# Altium schematic sheet IR_GATE_DRIVER_1.SchDoc: IR_GATE_DRIVER_1
size 420 x 297 mm; Engineer: ALPER KORKMAZ; SheetNumber: 5; SheetTotal: 8; SHEET: 5
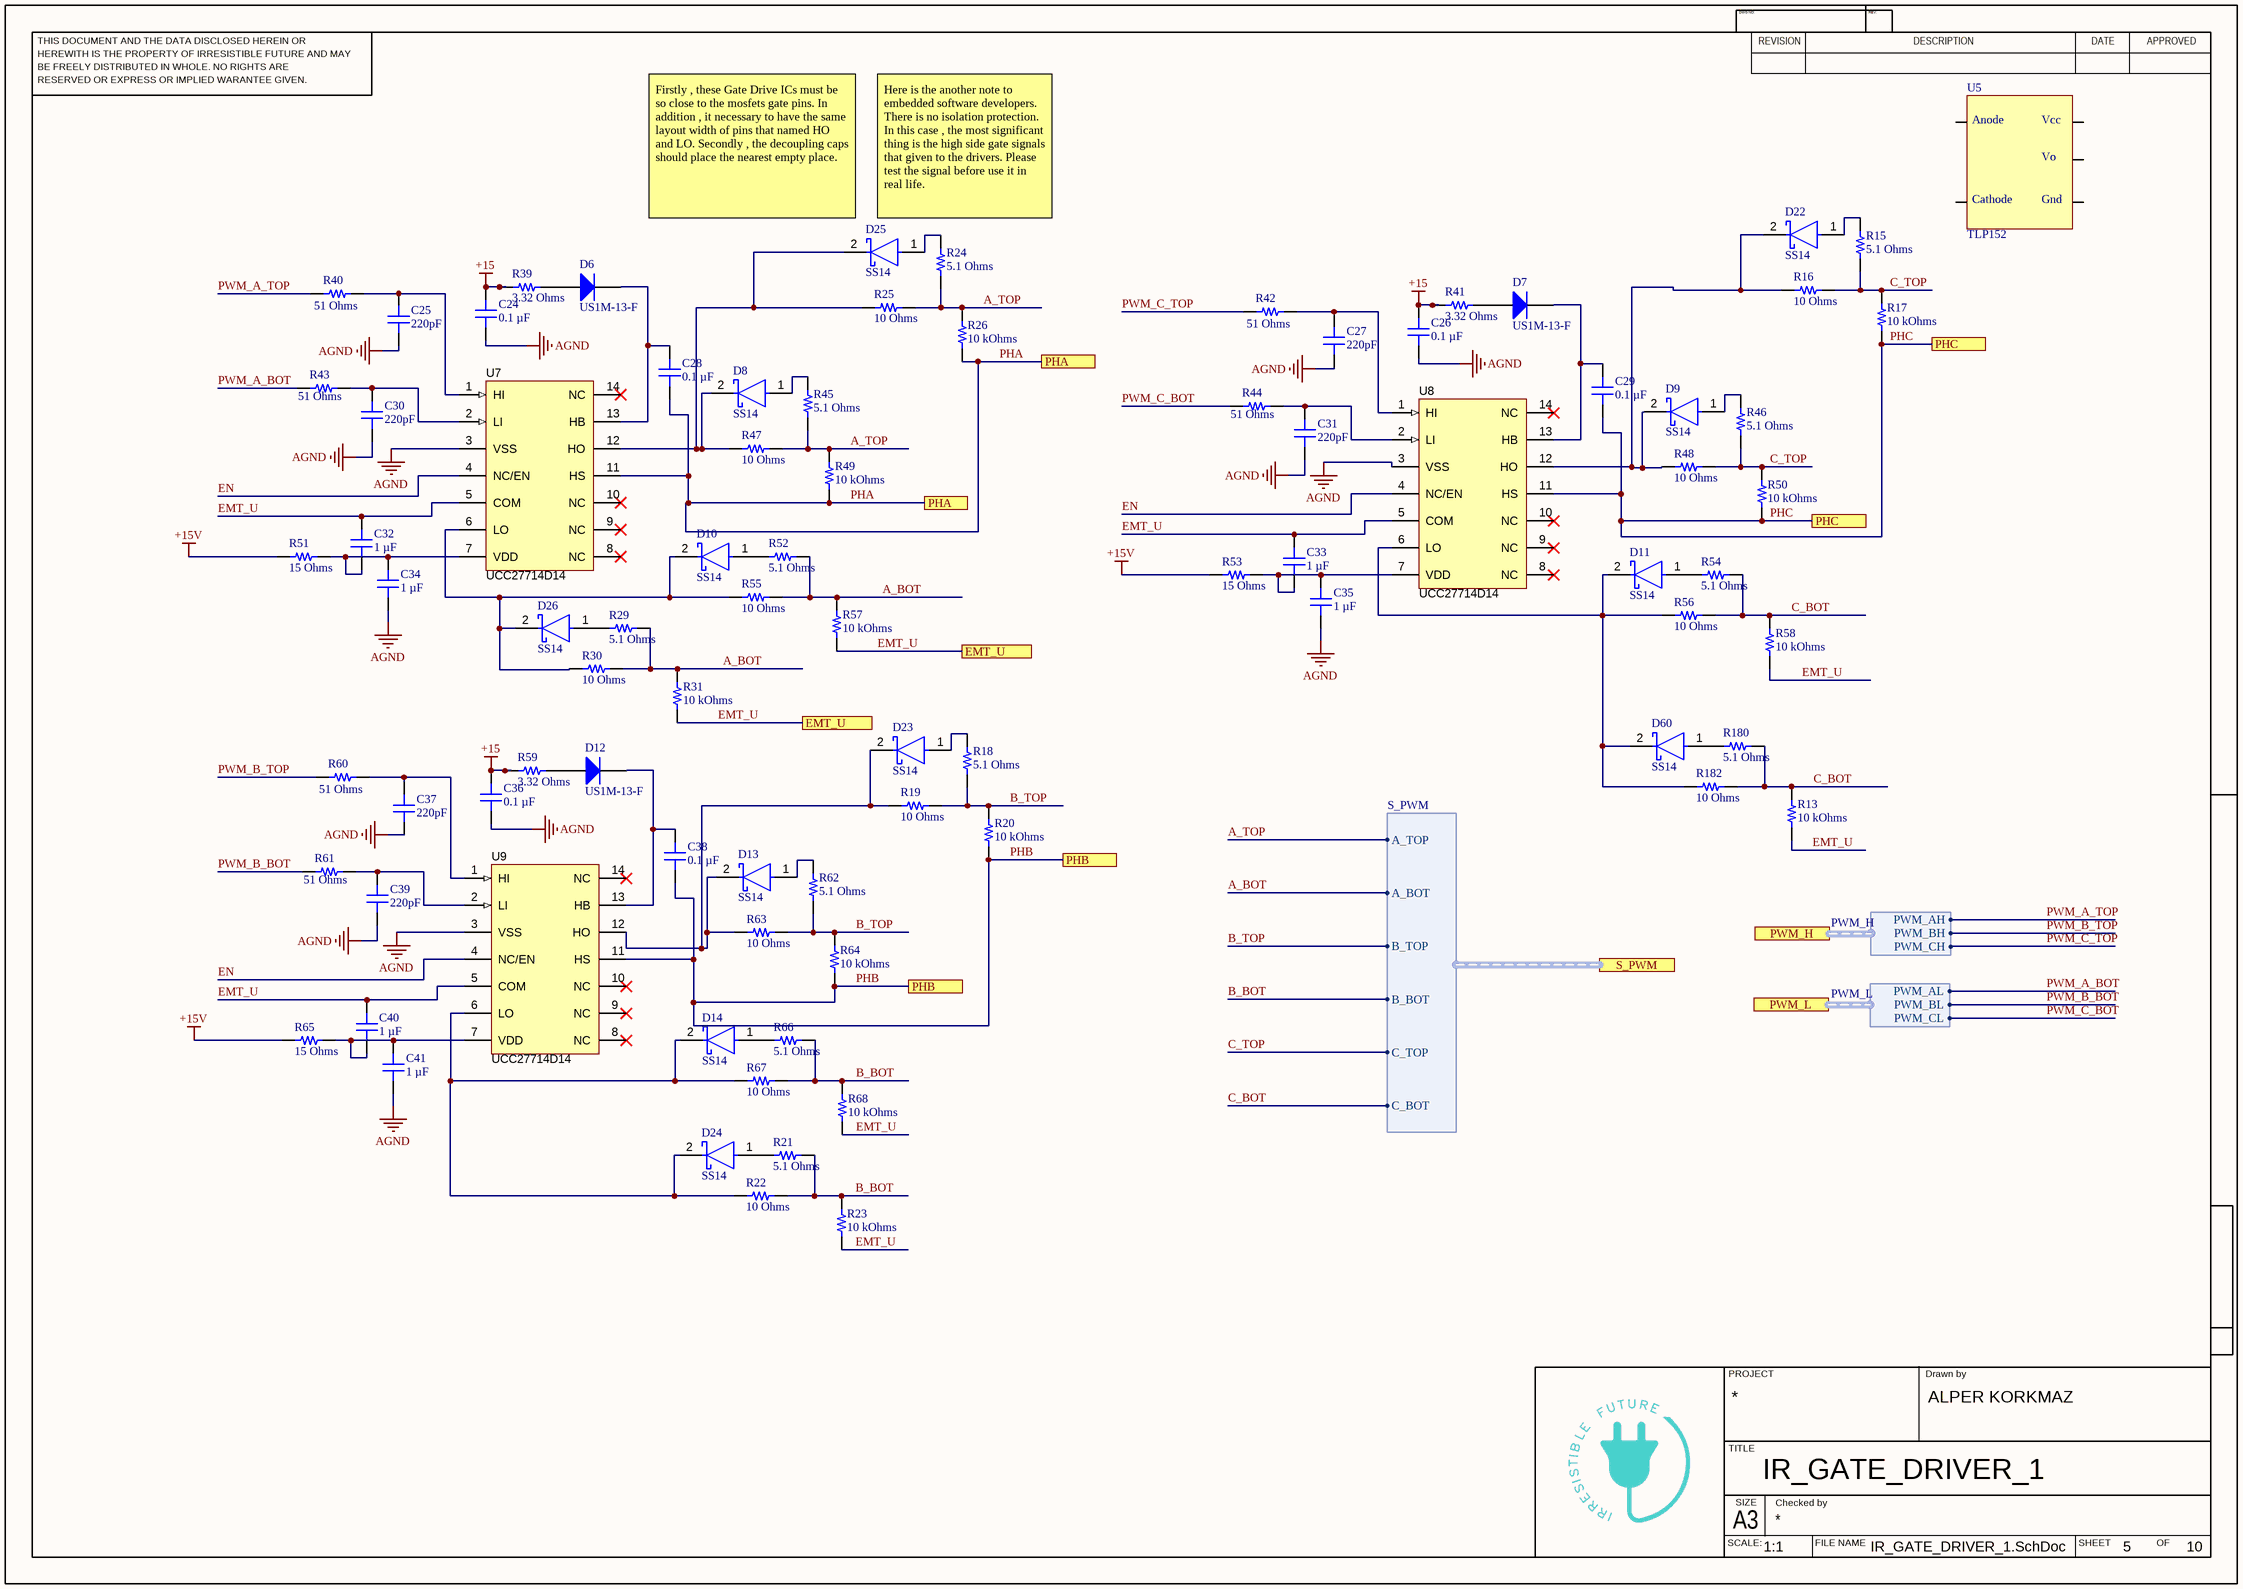
[diagram p0: IR_GATE_DRIVER_1.SchDoc]

## Parts
C24  0.1 µF  [CAP 0603_1608]
C25  220pF  [CAP 0603_1608]
C26  0.1 µF  [CAP 0603_1608]
C27  220pF  [CAP 0603_1608]
C28  0.1 µF  [CAP 0603_1608]
C29  0.1 µF  [CAP 0603_1608]
C30  220pF  [CAP 0603_1608]
C31  220pF  [CAP 0603_1608]
C32  1 µF  [CAP 0603_1608]
C33  1 µF  [CAP 0603_1608]
C34  1 µF  [CAP 0603_1608]
C35  1 µF  [CAP 0603_1608]
C36  0.1 µF  [CAP 0603_1608]
C37  220pF  [CAP 0603_1608]
C38  0.1 µF  [CAP 0603_1608]
C39  220pF  [CAP 0603_1608]
C40  1 µF  [CAP 0603_1608]
C41  1 µF  [CAP 0603_1608]
D6  US1M-13-F  [DIOD-SMA-2_A_V]
D7  US1M-13-F  [DIOD-SMA-2_A_V]
D8  SS14  [FP-403AE-MFG]
D9  SS14  [FP-403AE-MFG]
D10  SS14  [FP-403AE-MFG]
D11  SS14  [FP-403AE-MFG]
D12  US1M-13-F  [DIOD-SMA-2_A_V]
D13  SS14  [FP-403AE-MFG]
D14  SS14  [FP-403AE-MFG]
D22  SS14  [FP-403AE-MFG]
D23  SS14  [FP-403AE-MFG]
D24  SS14  [FP-403AE-MFG]
D25  SS14  [FP-403AE-MFG]
D26  SS14  [FP-403AE-MFG]
D60  SS14  [FP-403AE-MFG]
R13  10 kOhms  [RES 0603_1608]
R15  5.1 Ohms  [RES 0603_1608]
R16  10 Ohms  [RES 0603_1608]
R17  10 kOhms  [RES 0603_1608]
R18  5.1 Ohms  [RES 0603_1608]
R19  10 Ohms  [RES 0603_1608]
R20  10 kOhms  [RES 0603_1608]
R21  5.1 Ohms  [RES 0603_1608]
R22  10 Ohms  [RES 0603_1608]
R23  10 kOhms  [RES 0603_1608]
R24  5.1 Ohms  [RES 0603_1608]
R25  10 Ohms  [RES 0603_1608]
R26  10 kOhms  [RES 0603_1608]
R29  5.1 Ohms  [RES 0603_1608]
R30  10 Ohms  [RES 0603_1608]
R31  10 kOhms  [RES 0603_1608]
R39  3.32 Ohms  [RES 0603_1608]
R40  51 Ohms  [RES 0603_1608]
R41  3.32 Ohms  [RES 0603_1608]
R42  51 Ohms  [RES 0603_1608]
R43  51 Ohms  [RES 0603_1608]
R44  51 Ohms  [RES 0603_1608]
R45  5.1 Ohms  [RES 0603_1608]
R46  5.1 Ohms  [RES 0603_1608]
R47  10 Ohms  [RES 0603_1608]
R48  10 Ohms  [RES 0603_1608]
R49  10 kOhms  [RES 0603_1608]
R50  10 kOhms  [RES 0603_1608]
R51  15 Ohms  [RES 0603_1608]
R52  5.1 Ohms  [RES 0603_1608]
R53  15 Ohms  [RES 0603_1608]
R54  5.1 Ohms  [RES 0603_1608]
R55  10 Ohms  [RES 0603_1608]
R56  10 Ohms  [RES 0603_1608]
R57  10 kOhms  [RES 0603_1608]
R58  10 kOhms  [RES 0603_1608]
R59  3.32 Ohms  [RES 0603_1608]
R60  51 Ohms  [RES 0603_1608]
R61  51 Ohms  [RES 0603_1608]
R62  5.1 Ohms  [RES 0603_1608]
R63  10 Ohms  [RES 0603_1608]
R64  10 kOhms  [RES 0603_1608]
R65  15 Ohms  [RES 0603_1608]
R66  5.1 Ohms  [RES 0603_1608]
R67  10 Ohms  [RES 0603_1608]
R68  10 kOhms  [RES 0603_1608]
R180  5.1 Ohms  [RES 0603_1608]
R182  10 Ohms  [RES 0603_1608]
U5  TLP152  [TLP152]
U7  UCC27714D14  [D0014A_N]
U8  UCC27714D14  [D0014A_N]
U9  UCC27714D14  [D0014A_N]

## Ports
EMT_U (see 1[3A], 4[3D]), PHA (see 1[3A], 4[2B]), PHB (see 1[3A], 4[2C]), PHC (see 1[3A], 4[4B]), PWM_H (harness PWM_H, see 1[2A], 3[2B]), PWM_L (harness PWM_L, see 1[2A], 3[2B]), S_PWM (harness S_PWM, see 1[3A], 4[6C])

## Harnesses
S_PWM: A_TOP, A_BOT, B_TOP, B_BOT, C_TOP, C_BOT
PWM_H: PWM_CH, PWM_BH, PWM_AH
PWM_L: PWM_CL, PWM_BL, PWM_AL

## Nets
+15: C24.2 C26.2 C36.2 R39.1 R41.1 R59.1
+15V: R51.1 R53.1 R65.1
AGND: C24.1 C25.1 C26.1 C27.1 C30.1 C31.1 C34.1 C35.1 C36.1 C37.1 C39.1 C41.1 U7.3(VSS) U8.3(VSS) U9.3(VSS)
A_BOT: R29.2 R30.2 R31.2 R52.2 R55.2 R57.2 ; port S_PWM.A_BOT
A_TOP: R24.2 R25.2 R26.2 R45.2 R47.2 R49.2 ; port S_PWM.A_TOP
B_BOT: R21.2 R22.2 R23.2 R66.2 R67.2 R68.2 ; port S_PWM.B_BOT
B_TOP: R18.2 R19.2 R20.2 R62.2 R63.2 R64.2 ; port S_PWM.B_TOP
C_BOT: R13.2 R54.2 R56.2 R58.2 R180.2 R182.2 ; port S_PWM.C_BOT
C_TOP: R15.2 R16.2 R17.2 R46.2 R48.2 R50.2 ; port S_PWM.C_TOP
EMT_U: C32.2 C33.2 C40.2 R13.1 R23.1 R31.1 R57.1 R58.1 R68.1 U7.5(COM) U8.5(COM) U9.5(COM) ; port EMT_U
EN: U7.4(NC/EN) U8.4(NC/EN) U9.4(NC/EN)
PHA: C28.1 R26.1 R49.1 U7.11(HS) ; port PHA
PHB: C38.1 R20.1 R64.1 U9.11(HS) ; port PHB
PHC: C29.1 R17.1 R50.1 U8.11(HS) ; port PHC
PWM_A_BOT: R43.1 ; port PWM_L.PWM_AL
PWM_A_TOP: R40.1 ; port PWM_H.PWM_AH
PWM_B_BOT: R61.1 ; port PWM_L.PWM_BL
PWM_B_TOP: R60.1 ; port PWM_H.PWM_BH
PWM_C_BOT: R44.1 ; port PWM_L.PWM_CL
PWM_C_TOP: R42.1 ; port PWM_H.PWM_CH
NetC25_2: C25.2 R40.2 U7.1(HI)
NetC27_2: C27.2 R42.2 U8.1(HI)
NetC28_2: C28.2 D6.2(K) U7.13(HB)
NetC29_2: C29.2 D7.2(K) U8.13(HB)
NetC30_2: C30.2 R43.2 U7.2(LI)
NetC31_2: C31.2 R44.2 U8.2(LI)
NetC32_1: C32.1 C34.2 R51.2 U7.7(VDD)
NetC33_1: C33.1 C35.2 R53.2 U8.7(VDD)
NetC37_2: C37.2 R60.2 U9.1(HI)
NetC38_2: C38.2 D12.2(K) U9.13(HB)
NetC39_2: C39.2 R61.2 U9.2(LI)
NetC40_1: C40.1 C41.2 R65.2 U9.7(VDD)
NetD6_1: D6.1(A) R39.2
NetD7_1: D7.1(A) R41.2
NetD8_1: D8.1(A) R45.1
NetD8_2: D8.2(C) D25.2(C) R25.1 R47.1 U7.12(HO)
NetD9_1: D9.1(A) R46.1
NetD9_2: D9.2(C) D22.2(C) R16.1 R48.1 U8.12(HO)
NetD10_1: D10.1(A) R52.1
NetD10_2: D10.2(C) D26.2(C) R30.1 R55.1 U7.6(LO)
NetD11_1: D11.1(A) R54.1
NetD11_2: D11.2(C) D60.2(C) R56.1 R182.1 U8.6(LO)
NetD12_1: D12.1(A) R59.2
NetD13_1: D13.1(A) R62.1
NetD13_2: D13.2(C) D23.2(C) R19.1 R63.1 U9.12(HO)
NetD14_1: D14.1(A) R66.1
NetD14_2: D14.2(C) D24.2(C) R22.1 R67.1 U9.6(LO)
NetD22_1: D22.1(A) R15.1
NetD23_1: D23.1(A) R18.1
NetD24_1: D24.1(A) R21.1
NetD25_1: D25.1(A) R24.1
NetD26_1: D26.1(A) R29.1
NetD60_1: D60.1(A) R180.1

Not connected (* = marked no-connect by the designer): U5 1 2 3 4 5; U7 8(NC)* 9(NC)* 10(NC)* 14(NC)*; U8 8(NC)* 9(NC)* 10(NC)* 14(NC)*; U9 8(NC)* 9(NC)* 10(NC)* 14(NC)*

## Notes on the sheet
- (near D25) Firstly , these Gate Drive ICs must be so close to the mosfets gate pins. In addition , it necessary to have the same layout width of pins that named HO and LO. Secondly , the decoupling caps should place the nearest empty place.
- Here is the another note to embedded software developers. There is no isolation protection. In this case , the most significant thing is the high side gate signals that given to the drivers. Please test the signal before use it in real life.
- THIS DOCUMENT AND THE DATA DISCLOSED HEREIN OR
- HEREWITH IS THE PROPERTY OF IRRESISTIBLE FUTURE AND MAY
- DWG NO:
- REVISION
- REV:
- DESCRIPTION
- DATE
- APPROVED
- BE FREELY DISTRIBUTED IN WHOLE. NO RIGHTS ARE
- RESERVED OR EXPRESS OR IMPLIED WARANTEE GIVEN.
- PROJECT
- Drawn by
- TITLE
- SCALE:
- A3
- SIZE
- Checked by
- FILE NAME
- SHEET
- OF
- 1:1
- 10
- (in symbol TLP152(TPL,E) Anode; Vcc; Vo; Cathode; Gnd

## Library data of the parts
C24 C26 C28 C29 C36 C38 = C0603C104K5RAC7411: CAP CER 0.1UF 50V X7R 0603; manufacturer: KEMET; Tolerance: ±10%; Part Number: C0603C104K5RAC7411; Value: 0.1 µF; Applications: Bypass, Decoupling; Capacitance: 0.1 µF; componentlink1description: Datasheet; componentlink1url: https://api.kemet.com/component-edge/download/datasheet/C0603C104K5RAC7411.pdf; componentlink2description: DigiKey Link; componentlink2url: https://www.digikey.com/en/products/detail/kemet/C0603C104K5RAC7411/3317013; Device Package: 0603 (1608 Metric); lastupdated: 11.07.2022 14:43:54; Lifecycle Status: Active; Minimum Order: 15000; Mounting Type: Surface Mount, MLCC; Operating Temperature: -55°C ~ 125°C; Package / Case: 0603 (1608 Metric); packaging: TapeAndReel; partid: 2233; Part Status: Active; price: 0.01; series: SMD Comm X7R; Size / Dimension: 0.063" L x 0.031" W (1.60mm x 0.80mm); Supplier 1: DigiKey; Supplier Part Number 1: 399-7374-2-ND; Temperature Coefficient: X7R; Thickness (Max): 0.035" (0.90mm); Voltage - Rated: 50V
C25 C27 C30 C31 C37 C39 = 06031C221KAT2A: CAP CER 220PF 100V X7R 0603; manufacturer: AVX Corporation; Tolerance: ±10%; Part Number: 06031C221KAT2A; Value: 220pF; Applications: General Purpose; Capacitance: 220pF; componentlink1description: Datasheet; componentlink1url: http://datasheets.avx.com/X7RDielectric.pdf; componentlink2description: DigiKey Link; componentlink2url: http://digikey.com/product-detail/en/avx-corporation/06031C221KAT2A/478-1195-1-ND/564227; Device Package: 0603 (1608 Metric); lastupdated: 2.09.2020 01:03:35; Lifecycle Status: Active; Minimum Order: 1; Mounting Type: Surface Mount, MLCC; Operating Temperature: -55°C ~ 125°C; Package / Case: 0603 (1608 Metric); packaging: TapeAndReel; partid: 2841; Part Status: Active; price: 0.02; series: -; Size / Dimension: 0.063" L x 0.032" W (1.60mm x 0.81mm); Supplier 1: DigiKey; Supplier Part Number 1: 478-1195-1-ND; Temperature Coefficient: X7R; Thickness (Max): 0.035" (0.90mm); Voltage - Rated: 100V
C32-C35 C40 C41 = C0603C105K4RACAUTO: CAP CER 1UF 16V X7R 0603; manufacturer: KEMET; Tolerance: ±10%; Part Number: C0603C105K4RACAUTO; Value: 1 µF; Applications: Automotive, Bypass, Decoupling; Capacitance: 1 µF; componentlink1description: Datasheet; componentlink1url: https://api.kemet.com/component-edge/download/datasheet/C0603C105K4RACAUTO.pdf; componentlink2description: DigiKey Link; componentlink2url: https://www.digikey.com/en/products/detail/kemet/C0603C105K4RACAUTO/8635831; Device Package: 0603 (1608 Metric); lastupdated: 11.07.2022 14:43:54; Lifecycle Status: Active; Minimum Order: 1; Mounting Type: Surface Mount, MLCC; Operating Temperature: -55°C ~ 125°C; Package / Case: 0603 (1608 Metric); packaging: TapeAndReel; partid: 2179; Part Status: Active; price: 0.01; Ratings: AEC-Q200; series: SMD Auto X7R; Size / Dimension: 0.063" L x 0.031" W (1.60mm x 0.80mm); Supplier 1: DigiKey; Supplier Part Number 1: 399-17704-1-ND; Temperature Coefficient: X7R; Thickness (Max): 0.037" (0.95mm); Voltage - Rated: 16V
D6 D7 D12 = CMP-2000-07364-1: Ultra-Fast Rectifier, 1 A, 1.7 V, -65 to 150 degC, 2-Pin SMA, RoHS, Tape and Reel; Manufacturer: Diodes Inc; Forward Voltage: 1.7V; Reverse Recovery Time-Max: 75ns; Average Rectified Current-Max: 1A; Reverse Current-Max: 5µA; Reverse Voltage-Max [Vrrm]: 1000V; Package Description: 2-Pin Surface Mount Device, Body 4.3 x 2.605 mm; Datasheet URL: http://www.diodes.com/_files/datasheets/ds16008.pdf; Datasheet Version: Rev. 11-2, 12/2014; Package Reference: SMA-2; Mounting Technology: SurfaceMount; Manufacturer URL: http://www.diodes.com/
D8-D11 D13 D14 D22-D26 D60 = CMP-2000-04943-2: DIODE SCHOTTKY 40V 1A SMA; Manufacturer: ON Semiconductor; Peak Reverse Current: 0.2mA; Max Junction Temp: +125°C; Standoff Height: 0.05mm; Max Surge Forward Current: 40A; Mouser Description: Schottky Diodes & Rectifiers SMA 40V 1.0A; RoHS: TRUE; Lead Free: Yes; Manufacturer Part Number: SS14; Device Class L3: Schottky Diodes; Category: Diode; Automotive: No; Digikey Description: DIODE SCHOTTKY 40V 1A SMA; ComponentLink2Description: Datasheet; Device Class L2: Diodes; Height: 2.5mm; Temperature Range High: +125°C; ComponentLink2URL: https://www.onsemi.com/pub/Collateral/SS19-D.PDF; Device Class L1: Discrete Semiconductors; Package: 403AE; Octopart: https://octopart.com/ss14-on+semiconductor-29205033; Max Repetitive Reverse Voltage: 40V; Temperature Range Low: -65°C; Forward Current: 1A; Temperature: -65°C to +125°C
R13 R17 R20 R23 R26 R31 R49 R50 R57 R58 R64 R68 = RNCS0603BKE10K0: RES 10K OHM 0.1% 1/16W 0603; Manufacturer: Stackpole Electronics Inc; Power (Watts): 0.063W, 1/16W; Temperature Coefficient: ±25ppm/°C; Part Number: RNCS0603BKE10K0; Value: 10 kOhms; ComponentLink1Description: Datasheet; ComponentLink1URL: https://www.seielect.com/catalog/sei-rncs_rnch.pdf; ComponentLink2Description: DigiKey Link; ComponentLink2URL: https://www.digikey.com/en/products/detail/stackpole-electronics-inc/RNCS0603BKE10K0/1708836; Composition: Thin Film; Device Package: 0603 (1608 Metric); Features: Anti-Corrosive, Automotive AEC-Q200, Moisture Resistant; Height - Seated (Max): 0.022" (0.55mm); LastUpdated: 11.07.2022 15:05:17; Lifecycle Status: Active; Minimum Order: 1; Number of Terminations: 2; Operating Temperature: -55°C ~ 155°C; Package / Case: 0603 (1608 Metric); Packaging: TapeAndReel; PartId: 4838; Part Status: Active; Price: 0.08; Ratings: AEC-Q200; Resistance: 10 kOhms; Series: RNCS; Size / Dimension: 0.061" L x 0.031" W (1.55mm x 0.80mm); Supplier 1: DigiKey; Supplier Part Number 1: RNCS0603BKE10K0CT-ND; Supplier Device Package: 0603; Tolerance: ±0.1%
R15 R18 R21 R24 R29 R45 R46 R52 R54 R62 R66 R180 = SDR03EZPF5R10: HIGH ANTI-SURGE THICK FILM CHIP; Manufacturer: Rohm Semiconductor; Power (Watts): 0.3W; Temperature Coefficient: ±200ppm/°C; Tolerance: ±1%; Part Number: SDR03EZPF5R10; Value: 5.1 Ohms; ComponentLink1Description: Datasheet; ComponentLink1URL: https://fscdn.rohm.com/en/products/databook/datasheet/passive/resistor/chip_resistor/sdr-e.pdf; ComponentLink2Description: DigiKey Link; ComponentLink2URL: https://www.digikey.com/en/products/detail/rohm-semiconductor/SDR03EZPF5R10/16180067; Composition: Thick Film; Device Package: 0603 (1608 Metric); Features: Automotive AEC-Q200, Pulse Withstanding; Height - Seated (Max): 0.022" (0.55mm); LastUpdated: 11.07.2022 15:03:16; Lifecycle Status: Active; Minimum Order: 1; Number of Terminations: 2; Operating Temperature: -55°C ~ 155°C; Package / Case: 0603 (1608 Metric); Packaging: TapeAndReel; PartId: 68447; Part Status: Active; Price: 0.01; Ratings: AEC-Q200; Resistance: 5.1 Ohms; Series: SDR; Size / Dimension: 0.063" L x 0.031" W (1.60mm x 0.80mm); Supplier 1: DigiKey; Supplier Part Number 1: 511-SDR03EZPF5R10CT-ND; Supplier Device Package: 0603
R16 R19 R22 R25 R30 R47 R48 R55 R56 R63 R67 R182 = CRT0603-BY-10R0ELF: RES SMD 10 OHM 0.1% 1/10W 0603; Manufacturer: Bourns Inc.; Power (Watts): 0.1W, 1/10W; Temperature Coefficient: ±25ppm/°C; Part Number: CRT0603-BY-10R0ELF; Value: 10 Ohms; ComponentLink1Description: Datasheet; ComponentLink1URL: https://www.bourns.com/docs/Product-Datasheets/crt.pdf; ComponentLink2Description: DigiKey Link; ComponentLink2URL: https://www.digikey.com/en/products/detail/bourns-inc/CRT0603-BY-10R0ELF/1775018; Composition: Thin Film; Device Package: 0603 (1608 Metric); Features: Current Sense; Height - Seated (Max): 0.024" (0.60mm); LastUpdated: 11.07.2022 15:05:17; Lifecycle Status: Active; Minimum Order: 1; Number of Terminations: 2; Operating Temperature: -55°C ~ 155°C; Package / Case: 0603 (1608 Metric); Packaging: TapeAndReel; PartId: 4866; Part Status: Active; Price: 0.04; Resistance: 10 Ohms; Series: CRT; Size / Dimension: 0.061" L x 0.031" W (1.55mm x 0.80mm); Supplier 1: DigiKey; Supplier Part Number 1: CRT0603-BY-10R0ELFCT-ND; Supplier Device Package: 0603; Tolerance: ±0.1%
R39 R41 R59 = CPF0603B3R32E1: CPF 0603 3R32 0.1% 25PPM 1K RL; Manufacturer: TE Connectivity Passive Product; Power (Watts): 0.063W, 1/16W; Temperature Coefficient: ±25ppm/°C; Part Number: CPF0603B3R32E1; Value: 3.32 Ohms; ComponentLink1Description: Datasheet; ComponentLink1URL: https://www.te.com/commerce/DocumentDelivery/DDEController?Action=srchrtrv&DocNm=1773200&DocType=DS&DocLang=English; ComponentLink2Description: DigiKey Link; ComponentLink2URL: https://www.digikey.com/en/products/detail/te-connectivity-passive-product/CPF0603B3R32E1/14007032; Composition: Thin Film; Device Package: 0603 (1608 Metric); Height - Seated (Max): 0.022" (0.55mm); LastUpdated: 11.07.2022 15:03:42; Lifecycle Status: Active; Minimum Order: 1; Number of Terminations: 2; Operating Temperature: -55°C ~ 155°C; Package / Case: 0603 (1608 Metric); Packaging: TapeAndReel; PartId: 64124; Part Status: Active; Price: 0.13; Resistance: 3.32 Ohms; Series: CPF; Size / Dimension: 0.061" L x 0.031" W (1.55mm x 0.80mm); Supplier 1: DigiKey; Supplier Part Number 1: 1712-CPF0603B3R32E1CT-ND; Supplier Device Package: 0603; Tolerance: ±0.1%
R40 R42-R44 R60 R61 = CRCW060351R0JNEA: RES SMD 51 OHM 5% 1/10W 0603; Manufacturer: Vishay Dale; Power (Watts): 0.1W, 1/10W; Temperature Coefficient: ±200ppm/°C; Part Number: CRCW060351R0JNEA; Value: 51 Ohms; ComponentLink1Description: Datasheet; ComponentLink1URL: http://www.vishay.com/docs/20035/dcrcwe3.pdf; ComponentLink2Description: DigiKey Link; ComponentLink2URL: https://www.digikey.com/en/products/detail/vishay-dale/CRCW060351R0JNEA/1174198; Composition: Thick Film; Device Package: 0603 (1608 Metric); Features: Automotive AEC-Q200; Height - Seated (Max): 0.020" (0.50mm); LastUpdated: 11.07.2022 15:05:16; Lifecycle Status: Active; Minimum Order: 1; Number of Terminations: 2; Operating Temperature: -55°C ~ 155°C; Package / Case: 0603 (1608 Metric); Packaging: CutTape; PartId: 5142; Part Status: Active; Price: 0.01; Ratings: AEC-Q200; Resistance: 51 Ohms; Series: CRCW; Size / Dimension: 0.063" L x 0.033" W (1.60mm x 0.85mm); Supplier 1: DigiKey; Supplier Part Number 1: 541-51GCT-ND; Supplier Device Package: 0603; Tolerance: ±5%
R51 R53 R65 = CPF-A-0603B15RE: RES SMD 15 OHM 0.1% 1/16W 0603; Manufacturer: TE Connectivity Passive Product; Power (Watts): 0.063W, 1/16W; Temperature Coefficient: ±25ppm/°C; Part Number: CPF-A-0603B15RE; Value: 15 Ohms; ComponentLink1Description: Datasheet; ComponentLink1URL: https://www.te.com/commerce/DocumentDelivery/DDEController?Action=srchrtrv&DocNm=1773200-1&DocType=DS&DocLang=English; ComponentLink2Description: DigiKey Link; ComponentLink2URL: https://www.digikey.com/en/products/detail/te-connectivity-passive-product/CPF-A-0603B15RE/5583800; Composition: Thin Film; Device Package: 0603 (1608 Metric); Features: Anti-Sulfur, Automotive AEC-Q200, Moisture Resistant; Height - Seated (Max): 0.022" (0.55mm); LastUpdated: 11.07.2022 15:05:17; Lifecycle Status: Active; Minimum Order: 1; Number of Terminations: 2; Operating Temperature: -55°C ~ 155°C; Package / Case: 0603 (1608 Metric); Packaging: TapeAndReel; PartId: 4890; Part Status: Active; Price: 0.10; Ratings: AEC-Q200; Resistance: 15 Ohms; Series: CPF-A, Neohm; Size / Dimension: 0.061" L x 0.031" W (1.55mm x 0.80mm); Supplier 1: DigiKey; Supplier Part Number 1: 1712-CPF-A-0603B15RECT-ND; Supplier Device Package: 0603; Tolerance: ±0.1%
U5 = TLP152(TPL,E: OPTOISO 3.75KV GATE DRIVER 6SO-5; Manufacturer: Toshiba; Number of Channels: 1; Propagation Delay: 165ns; Max Power Dissipation: 260mW; Direction: Unidirectional; Turn-On Delay Time: 190ns; Fall Time: 22ns; Forward Voltage: 1.57V; Output Current: 2.5A; Forward Current: 10mA; Rise Time: 18ns; High Level Output Current: 2A; Pulse Width Distortion (PWD): 50ns; ComponentLink1URL: https://datasheet.ciiva.com/41848/tlp152-datasheet-en-20120914-41848928.pdf?src-supplier=Digi-Key; ComponentLink1Description: https://datasheet.ciiva.com/41848/tlp152-datasheet-en-20120914-41848928.pdf?src-supplier=Digi-Key; Supplier 1: Mouser; Manufacturer Part Number: TLP152(TPL,E; RoHS: Yes; Stock 1: 22321; Pricing 1: 1 = 1.55000, 10 = 0.96800, 50 = 0.96800, 100 = 0.87200, 1000 = 0.54300, 10000 = 0.44000 (USD); Mount: Surface Mount; Case/Package: SO; Number of Pins: 5; Min Operating Temperature: -40°C; Max Operating Temperature: 100°C; Packaging: Tape and Reel; Package Quantity: 3000; Low Level Output Current: 2A; Max Output Current: 2.5A; Supplier Part Number 1: 757-TLP152TPLE
U7-U9 = UCC27714D14: High-Speed Low-side Gate Driver Device, D0014A; Alternate Manufacturer: None; Manufacturer: Texas Instruments; SymbolCreator: a0411947; CompType: IC; U/M: EA; SymbolVersion: 2013-03-13; PartNumber: UCC27714D14; PackageReference: D0014A; MountType: SMT; ComponentLink1Description: Datasheet Link; ComponentLink1URL: https://sps06.itg.ti.com/sites/KMS/crossdivteams/altium/docs/ComponentDatasheets/UCC27714 Data Sheet Preliminary 3 12 2013.pdf; RoHS: Y; Publisher: Texas Instruments; LatestRevisionDate: 2014-07-15